# Altium schematic sheet MCUandMAX.SchDoc
size A
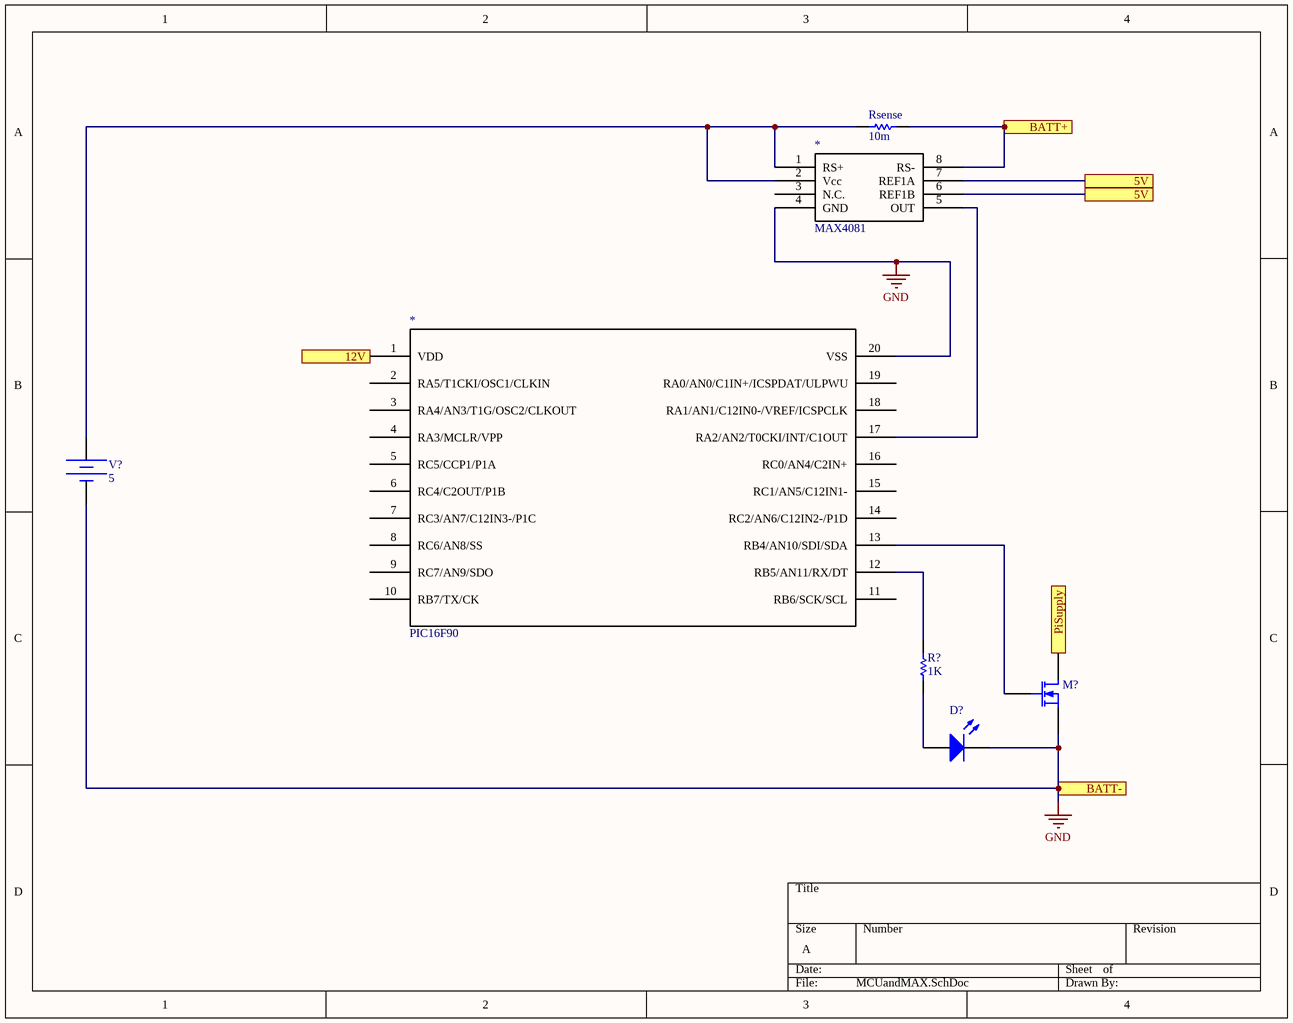
[diagram p0: MCUandMAX.SchDoc]

## Parts
(Parts that share a designator on the sheet are numbered #1, #2 ... from top to bottom, then left to right.)
*#1  MAX4081
*#2  PIC16F90  [Model Name]
D?  Light-Emitting Diode  (value not drawn)
M?  N-chanel Power MOSFET VDMOS Model  (value not drawn)
R?  value 1K  (hidden comment: Resistor)
Rsense  value 10m  (hidden comment: Resistor)
V?  DC Magnitude: 5  (hidden comment: Constant Voltage Source)

## Ports
5V, 12V, BATT+, BATT-, PiSupply

## Nets
GND: *#1.4(GND) *#2.20(VSS) D?.2(K) M?.3(S) V?.2 ; port BATT-
5V: *#1.6(REF1B) *#1.7(REF1A) ; port 5V
12V: *#2.1(VDD) ; port 12V
BATT+: *#1.8(RS-) Rsense.2 ; port BATT+
PiSupply: M?.1(D) ; port PiSupply
Net*#1_1: *#1.1(RS+) *#1.2(Vcc) Rsense.1 V?.1
Net*#1_5: *#1.5(OUT) *#2.17(RA2/AN2/T0CKI/INT/C1OUT)
Net*#2_12: *#2.12(RB5/AN11/RX/DT) R?.2
Net*#2_13: *#2.13(RB4/AN10/SDI/SDA) M?.2(G)
NetD?_1: D?.1(A) R?.1

Not connected (* = marked no-connect by the designer): *#1 3(N.C.); *#2 2(RA5/T1CKI/OSC1/CLKIN) 3(RA4/AN3/T1G/OSC2/CLKOUT) 4(RA3/MCLR/VPP) 5(RC5/CCP1/P1A) 6(RC4/C2OUT/P1B) 7(RC3/AN7/C12IN3-/P1C) 8(RC6/AN8/SS) 9(RC7/AN9/SDO) 10(RB7/TX/CK) 11(RB6/SCK/SCL) 14(RC2/AN6/C12IN2-/P1D) 15(RC1/AN5/C12IN1-) 16(RC0/AN4/C2IN+) 18(RA1/AN1/C12IN0-/VREF/ICSPCLK) 19(RA0/AN0/C1IN+/ICSPDAT/ULPWU)

## Library data of the parts
D? = LED: AF: 1; BV: 0; BV_MAX: 1e99; EG: 1.11; FC: 0.5; IBV: 0.001; IS: 1e-14; MJSW: 0.33; NTUN: 30; TNOM: 27; XTI: 3; SimulationGenericComponent: True; CJO: 0; CJP: 0; CTA: 0; CTP: 0; FCS: 0.5; FV_MAX: 1e99; IKF: 0; IKR: 0; ISR: 1e-14; JSW: 0; JTUN: 0; JTUNSW: 0; KEG: 1; KF: 0; LEVEL: 1; N: 1; NBV: 1; NR: 1; NS: 1; PHP: 1; RS: 0; TCV: 0; TLEV: 0; TLEVC: 0; TM1: 0; TM2: 0; TPB: 0; TPHP: 0; TRS: 0; TRS2: 0; TT: 0; TTT1: 0; TTT2: 0; VJ: 1; XTITUN: 3
M? = MOSFET N-ch VDMOS: XTI: 0; A: 1; BV: 1e30; EG: 1.11; FC: 0.5; IBV: 1e-10; IS: 1e-14; PHI: 0.6; TNOM: 27; VJ: 0.8; SimulationGenericComponent: True; CGDMAX: 0; CGDMIN: 0; CGS: 0; CJO: 0; KP: 1; KSUBTHRES: 0; LAMBDA: 0; M: 0.5; MTRIODE: 1; N: 1; NBV: 1; NCHAN: 1; RB: 0; RD: 0; RDS: 1e30; RG: 0; RQ: 0; RS: 0; SUBSHIFT: 0; SUBSLOPE: 0; THETA: 0; TT: 0; VQ: 0; VTO: 0
R? Rsense = Resistor: TC1: 0; SimulationGenericComponent: True; TC2: 0
V? = Battery: SimulationGenericComponent: True